# Altium schematic sheet DS18B20ConnectorBoard..SchDoc
size A4; SheetNumber: 1; SheetTotal: 1
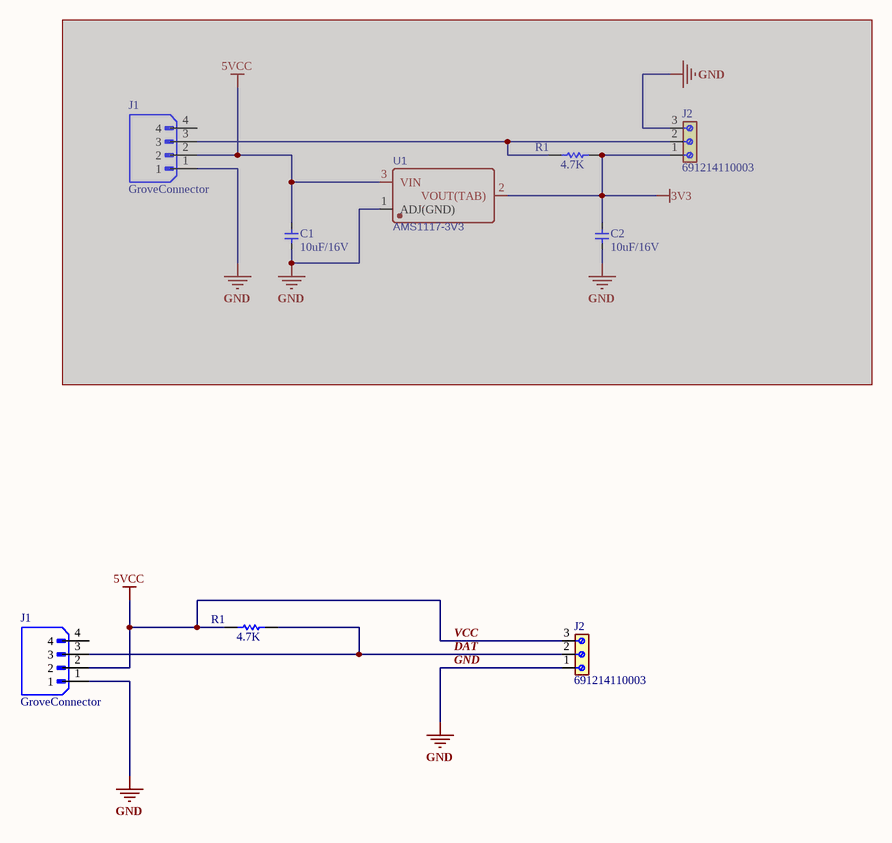
[diagram p0: DS18B20ConnectorBoard..SchDoc]

## Parts
(Parts that share a designator on the sheet are numbered #1, #2 ... from top to bottom, then left to right.)
C1  10uF/16V  [CAP-0603]  (masked out: inside a compile mask, not in the netlist)
C2  10uF/16V  [CAP-0603]  (masked out: inside a compile mask, not in the netlist)
J1#1  GroveConnector  [SEEEDSTUDIO_114020164]  (masked out: inside a compile mask, not in the netlist)
J1#2  GroveConnector  [SEEEDSTUDIO_114020164]
J2#1  691214110003  [691214110003]  (masked out: inside a compile mask, not in the netlist)
J2#2  691214110003  [691214110003]
R1#1  4.7K  [RES-0603]  (masked out: inside a compile mask, not in the netlist)
R1#2  4.7K  [RES-0603]
U1  AMS1117-3V3  [SOT-89]  (masked out: inside a compile mask, not in the netlist)

## Nets
GND: J1#2.1 J2#2.1
VCC: J1#2.2 J2#2.3 R1#2.2  [also labelled 5VCC]
DAT: J1#2.3 J2#2.2 R1#2.1

Not connected (* = marked no-connect by the designer): J1#2 4

## Notes on the sheet
- Project Manager
- Date:
- Designer
- Checked by
- Title
- Product
- Number:
- Rev:
- File:

## Library data of the parts
C1 C2 = CAP: LCSC Part NO: *; Manufacturer: *; Manufacturer Part Number: *; Package: *; Value: *; Digikey Part Number: *; Mouser Part Number: *
J1#1 J1#2 = 114020164: GROVE FEMALE HEADER R/A 20PACK; MF: Seeed Technology Co., Ltd; SnapEDA_Link: https://www.snapeda.com/parts/114020164/Seeed+Technology+Co.%252C+Ltd/view-part/?ref=snap; Package: None; Value: *; MP: 114020164; Check_prices: https://www.snapeda.com/parts/114020164/Seeed+Technology+Co.%252C+Ltd/view-part/?ref=eda
J2#1 J2#2 = 691214110003: 3 Position Wire to Board Terminal Block Horizontal with Board 0.138 (3.50mm) Through Hole; MF: Wurth Elektronik; SnapEDA_Link: https://www.snapeda.com/parts/691214110003/Wurth+Elektronik/view-part/?ref=snap; Package: None; Value: *; MP: 691214110003; Check_prices: https://www.snapeda.com/parts/691214110003/Wurth+Elektronik/view-part/?ref=eda
R1#1 R1#2 = RES: LCSC Part NO: *; Manufacturer: *; Manufacturer Part Number: *; Package: *; Value: *; Digikey Part Number: *; Mouser Part Number: *
U1 = AMS1117: BOM_Manufacturer: Youtai Semiconductor Co., Ltd.; BOM_Manufacturer Part: AMS1117-3.3; Contributor: LCSC; BOM_Supplier: LCSC; BOM_Supplier Part: C347256; BOM_JLCPCB Part Class: Extended Part; spicePre: U; spiceSymbolName: AMS1117-3.3_C347256